# Altium schematic sheet ReiAccept_RaspberryPiZeroKeyboard__pcb_AltiumDesigner__main.schdoc
size 508 x 400 mm
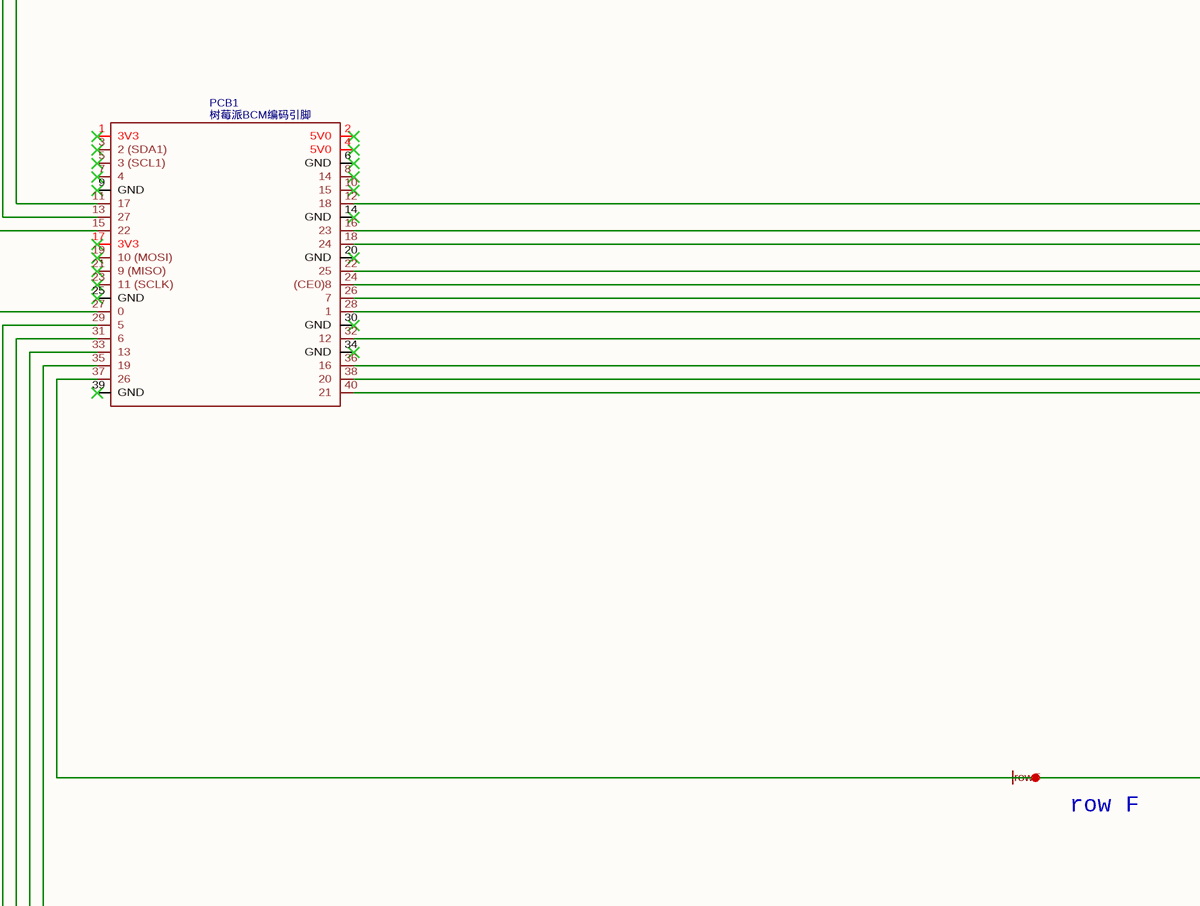
[diagram p0: ReiAccept_RaspberryPiZeroKeyboard__pcb_AltiumDesigner__main.schdoc, top left]
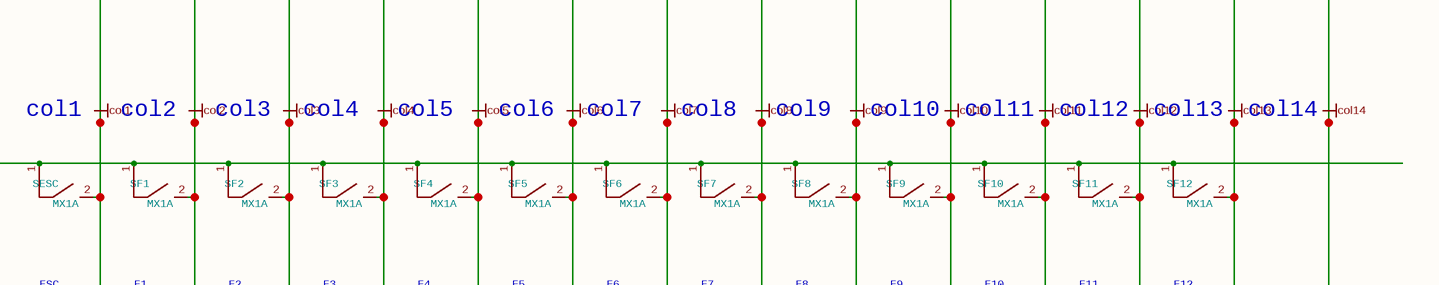
[diagram p1: ReiAccept_RaspberryPiZeroKeyboard__pcb_AltiumDesigner__main.schdoc, top right]
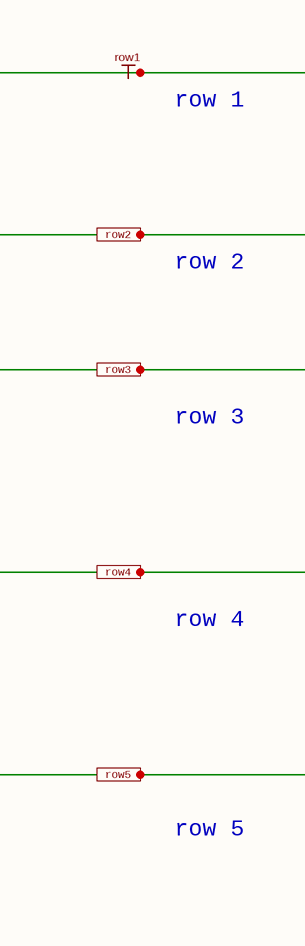
[diagram p2: ReiAccept_RaspberryPiZeroKeyboard__pcb_AltiumDesigner__main.schdoc, bottom left]
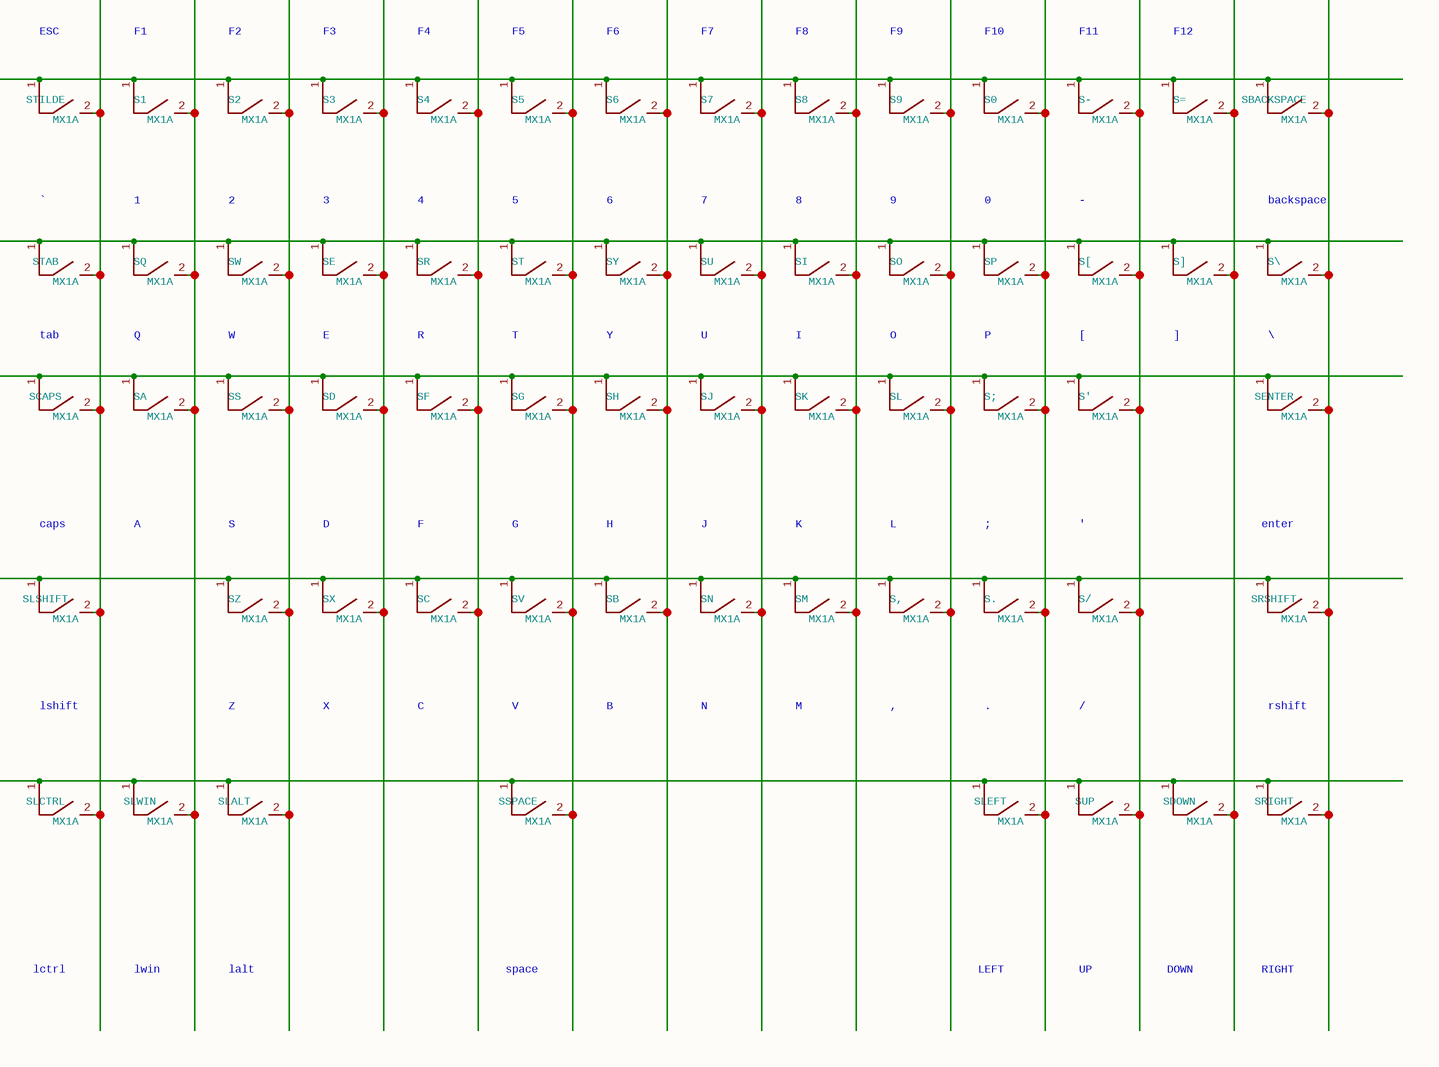
[diagram p3: ReiAccept_RaspberryPiZeroKeyboard__pcb_AltiumDesigner__main.schdoc, bottom right]

## Parts
PCB1  树莓派BCM编码引脚  [RASPBERRY PI ZERO (FACE UP) OUTLINE]
S0  MX1A  [MX1A]
S1  MX1A  [MX1A]
S2  MX1A  [MX1A]
S3  MX1A  [MX1A]
S4  MX1A  [MX1A]
S5  MX1A  [MX1A]
S6  MX1A  [MX1A]
S7  MX1A  [MX1A]
S8  MX1A  [MX1A]
S9  MX1A  [MX1A]
S'  MX1A  [MX1A]
S,  MX1A  [MX1A]
S-  MX1A  [MX1A]
S.  MX1A  [MX1A]
S/  MX1A  [MX1A]
S;  MX1A  [MX1A]
S=  MX1A  [MX1A]
S[  MX1A  [MX1A]
S\  MX1A  [MX1A]
S]  MX1A  [MX1A]
SA  MX1A  [MX1A]
SB  MX1A  [MX1A]
SBACKSPACE  MX1A  [MX1A]
SC  MX1A  [MX1A]
SCAPS  MX1A  [MX1A]
SD  MX1A  [MX1A]
SDOWN  MX1A  [MX1A_NO3D]
SE  MX1A  [MX1A]
SENTER  MX1A  [MX1A]
SESC  MX1A  [MX1A]
SF  MX1A  [MX1A]
SF1  MX1A  [MX1A]
SF2  MX1A  [MX1A]
SF3  MX1A  [MX1A]
SF4  MX1A  [MX1A]
SF5  MX1A  [MX1A]
SF6  MX1A  [MX1A]
SF7  MX1A  [MX1A]
SF8  MX1A  [MX1A]
SF9  MX1A  [MX1A]
SF10  MX1A  [MX1A]
SF11  MX1A  [MX1A]
SF12  MX1A  [MX1A]
SG  MX1A  [MX1A]
SH  MX1A  [MX1A]
SI  MX1A  [MX1A]
SJ  MX1A  [MX1A]
SK  MX1A  [MX1A]
SL  MX1A  [MX1A]
SLALT  MX1A  [MX1A]
SLCTRL  MX1A  [MX1A]
SLEFT  MX1A  [MX1A]
SLSHIFT  MX1A  [MX1A]
SLWIN  MX1A  [MX1A]
SM  MX1A  [MX1A]
SN  MX1A  [MX1A]
SO  MX1A  [MX1A]
SP  MX1A  [MX1A]
SQ  MX1A  [MX1A]
SR  MX1A  [MX1A]
SRIGHT  MX1A  [MX1A_NO3D]
SRSHIFT  MX1A  [MX1A]
SS  MX1A  [MX1A]
SSPACE  MX1A  [MX1A_NO3D]
ST  MX1A  [MX1A]
STAB  MX1A  [MX1A]
STILDE  MX1A  [MX1A]
SU  MX1A  [MX1A]
SUP  MX1A  [MX1A]
SV  MX1A  [MX1A]
SW  MX1A  [MX1A]
SX  MX1A  [MX1A]
SY  MX1A  [MX1A]
SZ  MX1A  [MX1A]

## Ports
row2 (in), row3 (in), row4 (in), row5 (in)

## Nets
rowF: PCB1.37(26) SESC.1 SF1.1 SF2.1 SF3.1 SF4.1 SF5.1 SF6.1 SF7.1 SF8.1 SF9.1 SF10.1 SF11.1 SF12.1
row2: PCB1.33(13) S[.1 S\.1 S].1 SE.1 SI.1 SO.1 SP.1 SQ.1 SR.1 ST.1 STAB.1 SU.1 SW.1 SY.1 ; port row2
row3: PCB1.31(6) S'.1 S;.1 SA.1 SCAPS.1 SD.1 SENTER.1 SF.1 SG.1 SH.1 SJ.1 SK.1 SL.1 SS.1 ; port row3
row4: PCB1.29(5) S,.1 S..1 S/.1 SB.1 SC.1 SLSHIFT.1 SM.1 SN.1 SRSHIFT.1 SV.1 SX.1 SZ.1 ; port row4
row5: PCB1.27(0) SDOWN.1 SLALT.1 SLCTRL.1 SLEFT.1 SLWIN.1 SRIGHT.1 SSPACE.1 SUP.1 ; port row5
NetPCB1_11: PCB1.11(17) S'.2 S-.2 S/.2 S[.2 SF11.2 SUP.2
NetPCB1_12: PCB1.12(18) S0.2 S..2 S;.2 SF10.2 SLEFT.2 SP.2
NetPCB1_13: PCB1.13(27) S=.2 S].2 SDOWN.2 SF12.2
NetPCB1_15: PCB1.15(22) S\.2 SBACKSPACE.2 SENTER.2 SRIGHT.2 SRSHIFT.2
NetPCB1_16: PCB1.16(23) S9.2 S,.2 SF9.2 SL.2 SO.2
NetPCB1_18: PCB1.18(24) S8.2 SF8.2 SI.2 SK.2 SM.2
NetPCB1_22: PCB1.22(25) S7.2 SF7.2 SJ.2 SN.2 SU.2
NetPCB1_24: PCB1.24((CE0)8) S6.2 SB.2 SF6.2 SH.2 SY.2
NetPCB1_26: PCB1.26(7) S5.2 SF5.2 SG.2 SSPACE.2 ST.2 SV.2
NetPCB1_28: PCB1.28(1) S4.2 SC.2 SF.2 SF4.2 SR.2
NetPCB1_32: PCB1.32(12) S3.2 SD.2 SE.2 SF3.2 SX.2
NetPCB1_35: PCB1.35(19) S0.1 S1.1 S2.1 S3.1 S4.1 S5.1 S6.1 S7.1 S8.1 S9.1 S-.1 S=.1 SBACKSPACE.1 STILDE.1
NetPCB1_36: PCB1.36(16) S2.2 SF2.2 SLALT.2 SS.2 SW.2 SZ.2
NetPCB1_38: PCB1.38(20) S1.2 SA.2 SF1.2 SLWIN.2 SQ.2
NetPCB1_40: PCB1.40(21) SCAPS.2 SESC.2 SLCTRL.2 SLSHIFT.2 STAB.2 STILDE.2

Not connected (* = marked no-connect by the designer): PCB1 1(3V3)* 2(5V0)* 3(2_(SDA1))* 4(5V0)* 5(3_(SCL1))* 6(GND)* 7(4)* 8(14)* 9(GND)* 10(15)* 14(GND)* 17(3V3)* 19(10_(MOSI))* 20(GND)* 21(9_(MISO))* 23(11_(SCLK))* 25(GND)* 30(GND)* 34(GND)* 39(GND)*

## Notes on the sheet
- col1
- col2
- col3
- col4
- col5
- col6
- col7
- col8
- col9
- col10
- col11
- col12
- col13
- col14
- row F
- ESC
- F1
- F2
- F3
- F4
- F5
- F6
- F7
- F8
- F9
- F10
- F11
- F12
- row 1
- (near STAB) `
- 1
- 2
- 3
- 4
- 5
- 6
- 7
- 8
- 9
- 0
- -
- backspace
- row 2
- tab
- Q
- W
- E
- R
- T
- Y
- U
- I
- O
- P
- [
- ]
- \
- row 3
- caps
- A
- S
- D
- F
- G
- H
- J
- K
- L
- ;
- '
- enter
- row 4
- lshift
- Z
- X
- C
- V
- B
- N
- M
- ,
- .
- /
- rshift
- row 5
- lctrl
- lwin
- lalt
- space
- LEFT
- UP
- DOWN
- RIGHT
- Labels drawn without touching a wire or pin: col1, col2, col3, col4, col5, col6, col7, col8, col9, col10, col11, col12, col13, col14, row1

## Library data of the parts
PCB1 = 树莓派BCM编码引脚: BOM_Manufacturer: raspberry; description: Raspberry Pi Zero; sourceId: a8qICUO6o; Contributor: luck88431844; timeStamp: 1464116511; BOM_Supplier: raspberry; spicePre: P; spiceSymbolName: 树莓派 zero w BCM编码引脚